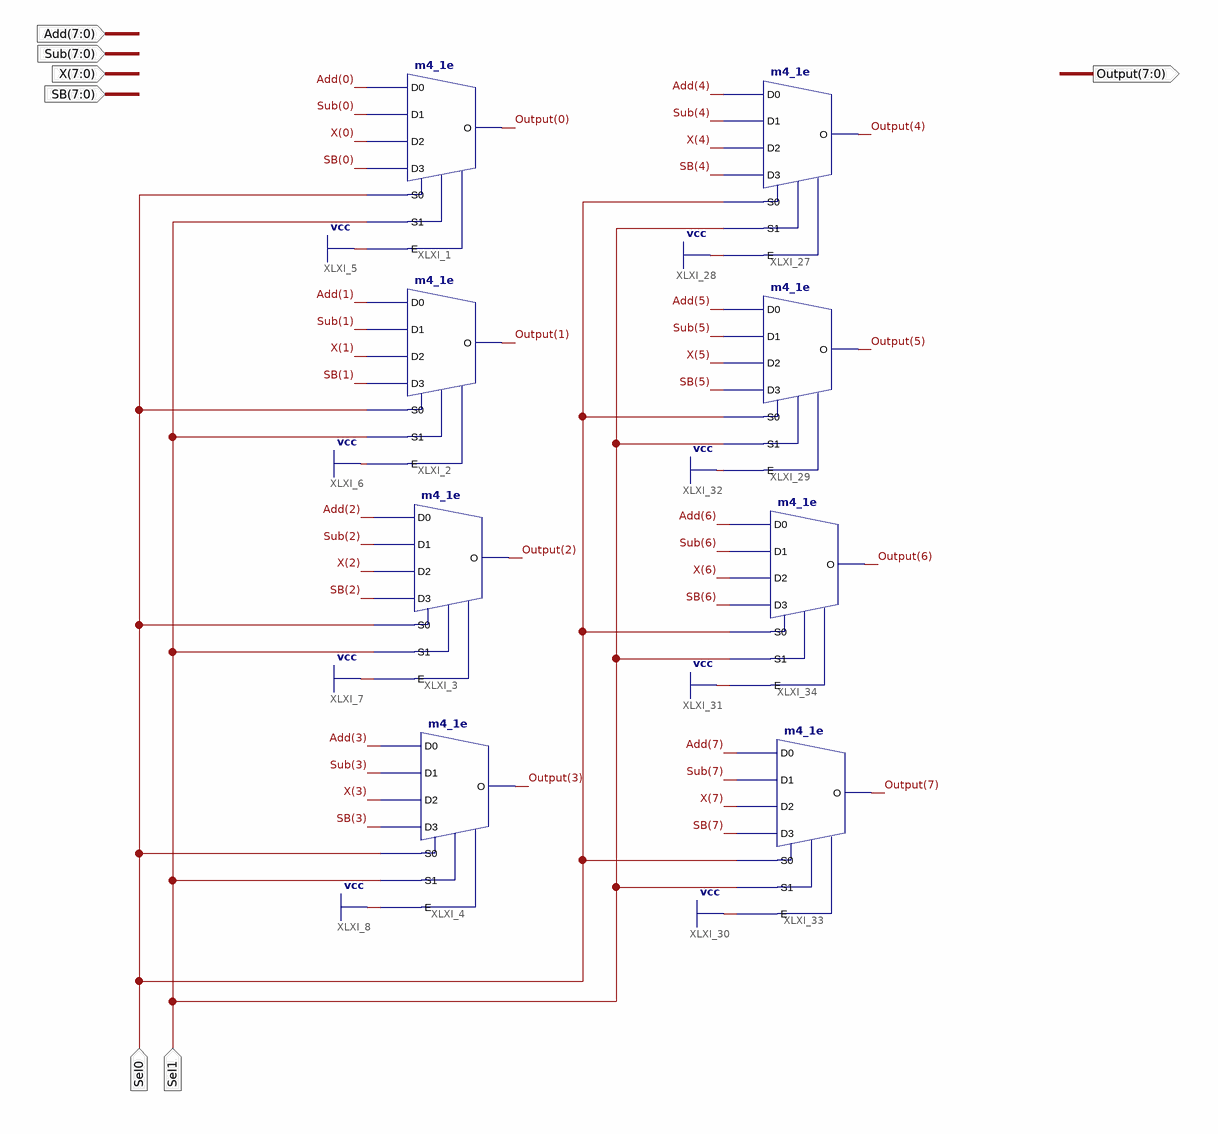
[diagram p0: schematic sheet 1]
// Xilinx ISE schematic InputSelect4_1.sch (spartan6) as structural Verilog: 8 symbols, 7 ports
module InputSelect4_1 (
  input  [7:0] Add,
  input  [7:0] Sub,
  input  [7:0] X,
  input  [7:0] SB,
  input  Sel0,
  input  Sel1,
  output [7:0] Output
);

  m4_1e XLXI_1 (.D0(Add[0]), .D1(Sub[0]), .D2(X[0]), .D3(SB[0]), .E(1'b1), .S0(Sel0), .S1(Sel1), .O(Output[0]));
  m4_1e XLXI_2 (.D0(Add[1]), .D1(Sub[1]), .D2(X[1]), .D3(SB[1]), .E(1'b1), .S0(Sel0), .S1(Sel1), .O(Output[1]));
  m4_1e XLXI_4 (.D0(Add[3]), .D1(Sub[3]), .D2(X[3]), .D3(SB[3]), .E(1'b1), .S0(Sel0), .S1(Sel1), .O(Output[3]));
  m4_1e XLXI_3 (.D0(Add[2]), .D1(Sub[2]), .D2(X[2]), .D3(SB[2]), .E(1'b1), .S0(Sel0), .S1(Sel1), .O(Output[2]));
  m4_1e XLXI_27 (.D0(Add[4]), .D1(Sub[4]), .D2(X[4]), .D3(SB[4]), .E(1'b1), .S0(Sel0), .S1(Sel1), .O(Output[4]));
  m4_1e XLXI_29 (.D0(Add[5]), .D1(Sub[5]), .D2(X[5]), .D3(SB[5]), .E(1'b1), .S0(Sel0), .S1(Sel1), .O(Output[5]));
  m4_1e XLXI_33 (.D0(Add[7]), .D1(Sub[7]), .D2(X[7]), .D3(SB[7]), .E(1'b1), .S0(Sel0), .S1(Sel1), .O(Output[7]));
  m4_1e XLXI_34 (.D0(Add[6]), .D1(Sub[6]), .D2(X[6]), .D3(SB[6]), .E(1'b1), .S0(Sel0), .S1(Sel1), .O(Output[6]));
endmodule
